# EAGLE design LED Controller (EAGLE 9.5.2)

## Sheet 1 of 3: MCU
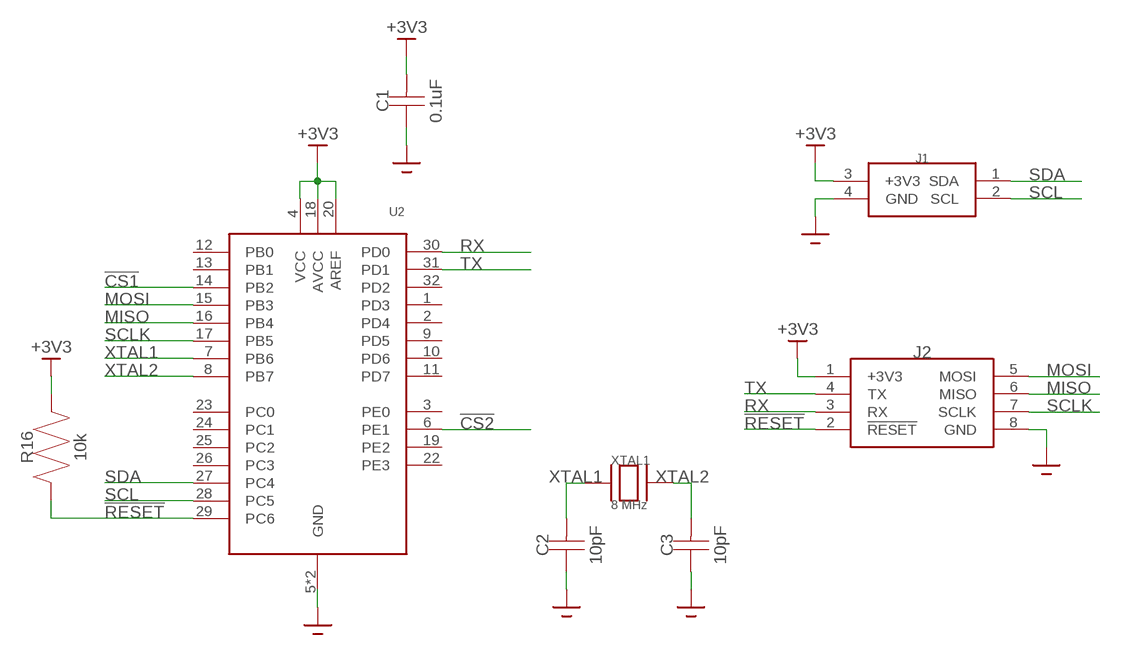
[diagram p0: schematic, sheet 1]

### Parts
C1  0.1uF  CAPACITOR0805  [0805]
C2  10pF  CAPACITOR0805  [0805]
C3  10pF  CAPACITOR0805  [0805]
J1  1-770968-0  [1-770968-0]
J2  DF1BZ-8DP-2.5DSA  [DF1BZ-8DP-2.5DSA]
R16  10k  RESISTOR0805  [0805]
U2  ATMEGA328PB32-TQFP  [ATMEGA328PB]
XTAL1  8 MHz  XRCGB  [XRCGB]

### Nets
!CS1: U2.14(PB2) ; also sheet 2
!CS2: U2.6(PE1) ; also sheet 2
!RESET: J2.2(!RESET) R16.P$1 U2.29(PC6)
+3V3: C1.P$2 J1.3(+3V3) J2.1(+3V3) R16.P$2 U2.4(VCC) U2.18(AVCC) U2.20(AREF) ; also sheet 2
GND: C1.P$1 C2.P$1 C3.P$1 J1.4(GND) J2.8(GND) U2.5(GND) U2.21(GND) ; also sheet 2
MISO: J2.6(MISO) U2.16(PB4) ; also sheet 2
MOSI: J2.5(MOSI) U2.15(PB3) ; also sheet 2
RX: J2.3(RX) U2.30(PD0)
SCL: J1.2(SCL) U2.28(PC5)
SCLK: J2.7(SCLK) U2.17(PB5) ; also sheet 2
SDA: J1.1(SDA) U2.27(PC4)
TX: J2.4(TX) U2.31(PD1)
XTAL1: C2.P$2 U2.7(PB6) XTAL1.1 XTAL1.3
XTAL2: C3.P$2 U2.8(PB7) XTAL1.2 XTAL1.4
Unconnected: U2.1(PD3) U2.2(PD4) U2.3(PE0) U2.9(PD5) U2.10(PD6) U2.11(PD7) U2.12(PB0) U2.13(PB1) U2.19(PE2) U2.22(PE3) U2.23(PC0) U2.24(PC1) U2.25(PC2) U2.26(PC3) U2.32(PD2)

## Sheet 2 of 3: IO Expanders
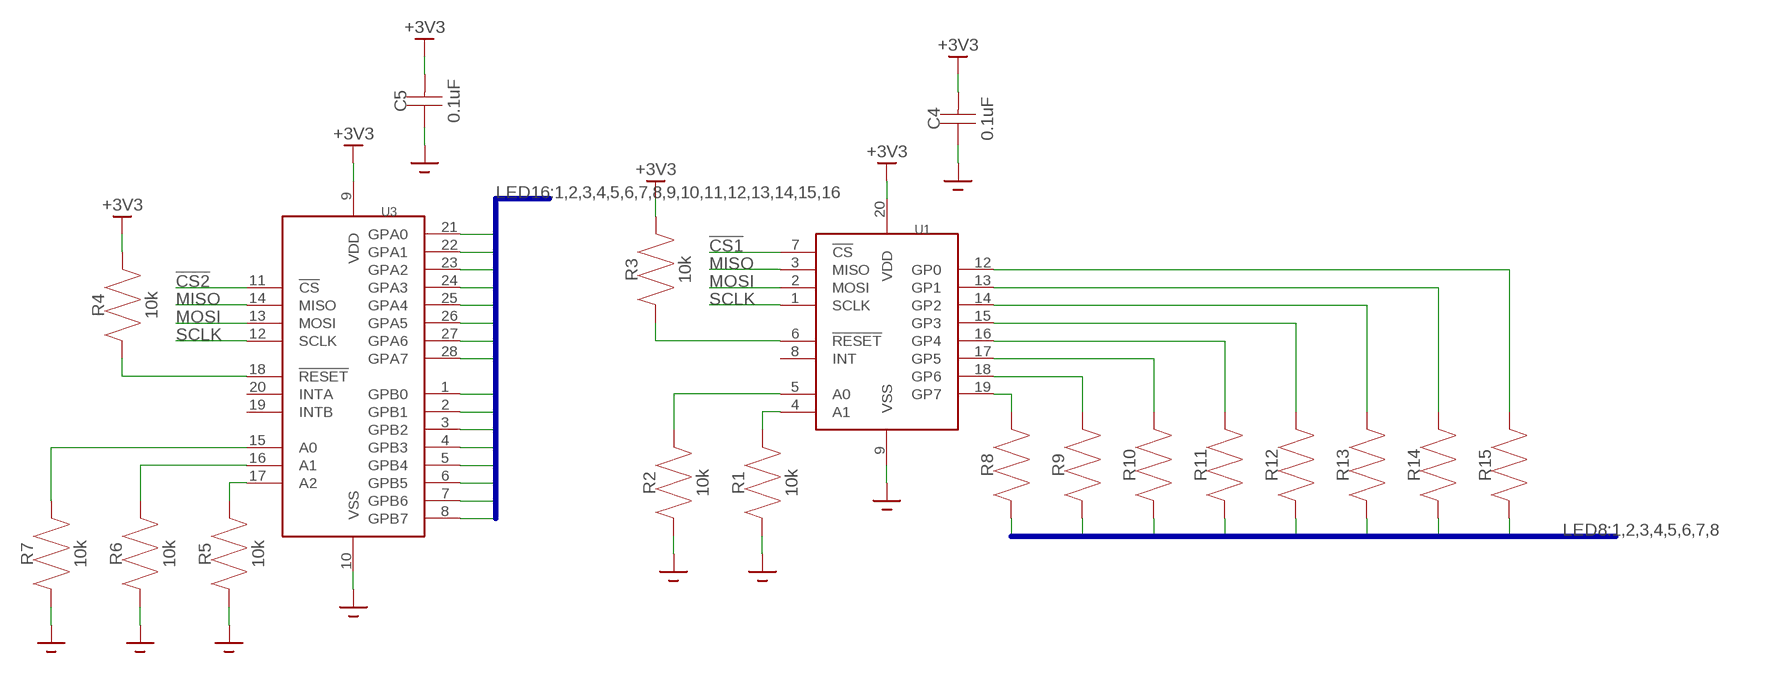
[diagram p1: schematic, sheet 2]

### Parts
C4  0.1uF  CAPACITOR0805  [0805]
C5  0.1uF  CAPACITOR0805  [0805]
R1  10k  RESISTOR0805  [0805]
R2  10k  RESISTOR0805  [0805]
R3  10k  RESISTOR0805  [0805]
R4  10k  RESISTOR0805  [0805]
R5  10k  RESISTOR0805  [0805]
R6  10k  RESISTOR0805  [0805]
R7  10k  RESISTOR0805  [0805]
R8  RESISTOR0805  [0805]
R9  RESISTOR0805  [0805]
R10  RESISTOR0805  [0805]
R11  RESISTOR0805  [0805]
R12  RESISTOR0805  [0805]
R13  RESISTOR0805  [0805]
R14  RESISTOR0805  [0805]
R15  RESISTOR0805  [0805]
U1  MCP23S08-E/SO  [MCP23S08-E/SO]
U3  MCP23S17T-E/SO  [MCP23S17T-E/SO]

### Nets
1: U3.21(GPA0) ; also sheet 3
2: U3.22(GPA1) ; also sheet 3
3: U3.23(GPA2) ; also sheet 3
4: U3.24(GPA3) ; also sheet 3
5: U3.25(GPA4) ; also sheet 3
6: U3.26(GPA5) ; also sheet 3
7: U3.27(GPA6) ; also sheet 3
8: U3.28(GPA7) ; also sheet 3
9: U3.1(GPB0) ; also sheet 3
10: U3.2(GPB1) ; also sheet 3
11: U3.3(GPB2) ; also sheet 3
12: U3.4(GPB3) ; also sheet 3
13: U3.5(GPB4) ; also sheet 3
14: U3.6(GPB5) ; also sheet 3
15: U3.7(GPB6) ; also sheet 3
16: U3.8(GPB7) ; also sheet 3
!CS1: U1.7(!CS) ; also sheet 1
!CS2: U3.11(!CS) ; also sheet 1
+3V3: C4.P$2 C5.P$2 R3.P$2 R4.P$2 U1.20(VDD) U3.9(VDD) ; also sheet 1
A: R15.P$1 ; also sheet 3
B: R14.P$1 ; also sheet 3
C: R13.P$1 ; also sheet 3
D: R12.P$1 ; also sheet 3
E: R11.P$1 ; also sheet 3
F: R10.P$1 ; also sheet 3
G: R9.P$1 ; also sheet 3
GND: C4.P$1 C5.P$1 R1.P$1 R2.P$1 R5.P$1 R6.P$1 R7.P$1 U1.9(VSS) U3.10(VSS) ; also sheet 1
H: R8.P$1 ; also sheet 3
MISO: U1.3(MISO) U3.14(MISO) ; also sheet 1
MOSI: U1.2(MOSI) U3.13(MOSI) ; also sheet 1
N$1: R1.P$2 U1.4(A1)
N$2: R2.P$2 U1.5(A0)
N$3: R3.P$1 U1.6(!RESET)
N$4: R4.P$1 U3.18(!RESET)
N$5: R5.P$2 U3.17(A2)
N$6: R6.P$2 U3.16(A1)
N$7: R7.P$2 U3.15(A0)
N$8: R8.P$2 U1.19(GP7)
N$9: R9.P$2 U1.18(GP6)
N$10: R10.P$2 U1.17(GP5)
N$11: R11.P$2 U1.16(GP4)
N$12: R12.P$2 U1.15(GP3)
N$13: R13.P$2 U1.14(GP2)
N$14: R14.P$2 U1.13(GP1)
N$15: R15.P$2 U1.12(GP0)
SCLK: U1.1(SCLK) U3.12(SCLK) ; also sheet 1
Unconnected: U1.8(INT) U3.19(INTB) U3.20(INTA)

### Buses
LED8:1,2,3,4,5,6,7,8
LED16:1,2,3,4,5,6,7,8,9,10,11,12,13,14,15,16

## Sheet 3 of 3: Interface
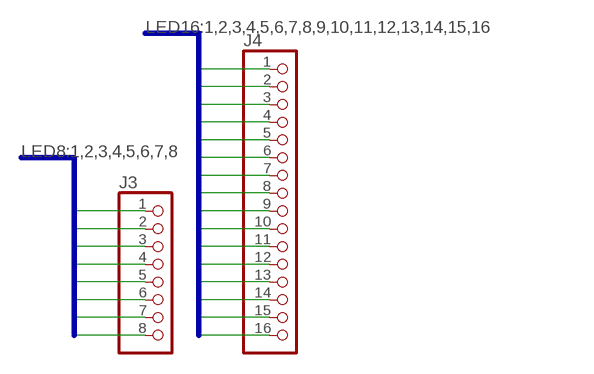
[diagram p2: schematic, sheet 3]

### Parts
J3  LED8  [LED8]
J4  LED16  [LED16]

### Nets
1: J4.1 ; also sheet 2
2: J4.2 ; also sheet 2
3: J4.3 ; also sheet 2
4: J4.4 ; also sheet 2
5: J4.5 ; also sheet 2
6: J4.6 ; also sheet 2
7: J4.7 ; also sheet 2
8: J4.8 ; also sheet 2
9: J4.9 ; also sheet 2
10: J4.10 ; also sheet 2
11: J4.11 ; also sheet 2
12: J4.12 ; also sheet 2
13: J4.13 ; also sheet 2
14: J4.14 ; also sheet 2
15: J4.15 ; also sheet 2
16: J4.16 ; also sheet 2
A: J3.1 ; also sheet 2
B: J3.2 ; also sheet 2
C: J3.3 ; also sheet 2
D: J3.4 ; also sheet 2
E: J3.5 ; also sheet 2
F: J3.6 ; also sheet 2
G: J3.7 ; also sheet 2
H: J3.8 ; also sheet 2

### Buses
LED8:1,2,3,4,5,6,7,8
LED16:1,2,3,4,5,6,7,8,9,10,11,12,13,14,15,16

## Library data of the parts
C1-C5 = Zach:CAPACITOR
J1 = Zach:1-770968-0
J2 = Zach:DF1BZ-8DP-2.5DSA
J3 = Zach:LED8
J4 = Zach:LED16
R1-R16 = Zach:RESISTOR
U1 = Zach:MCP23S08-E/SO
U2 = Zach:ATMEGA328PB
U3 = Zach:MCP23S17T-E/SO
XTAL1 = Zach:XRCGB

## Board
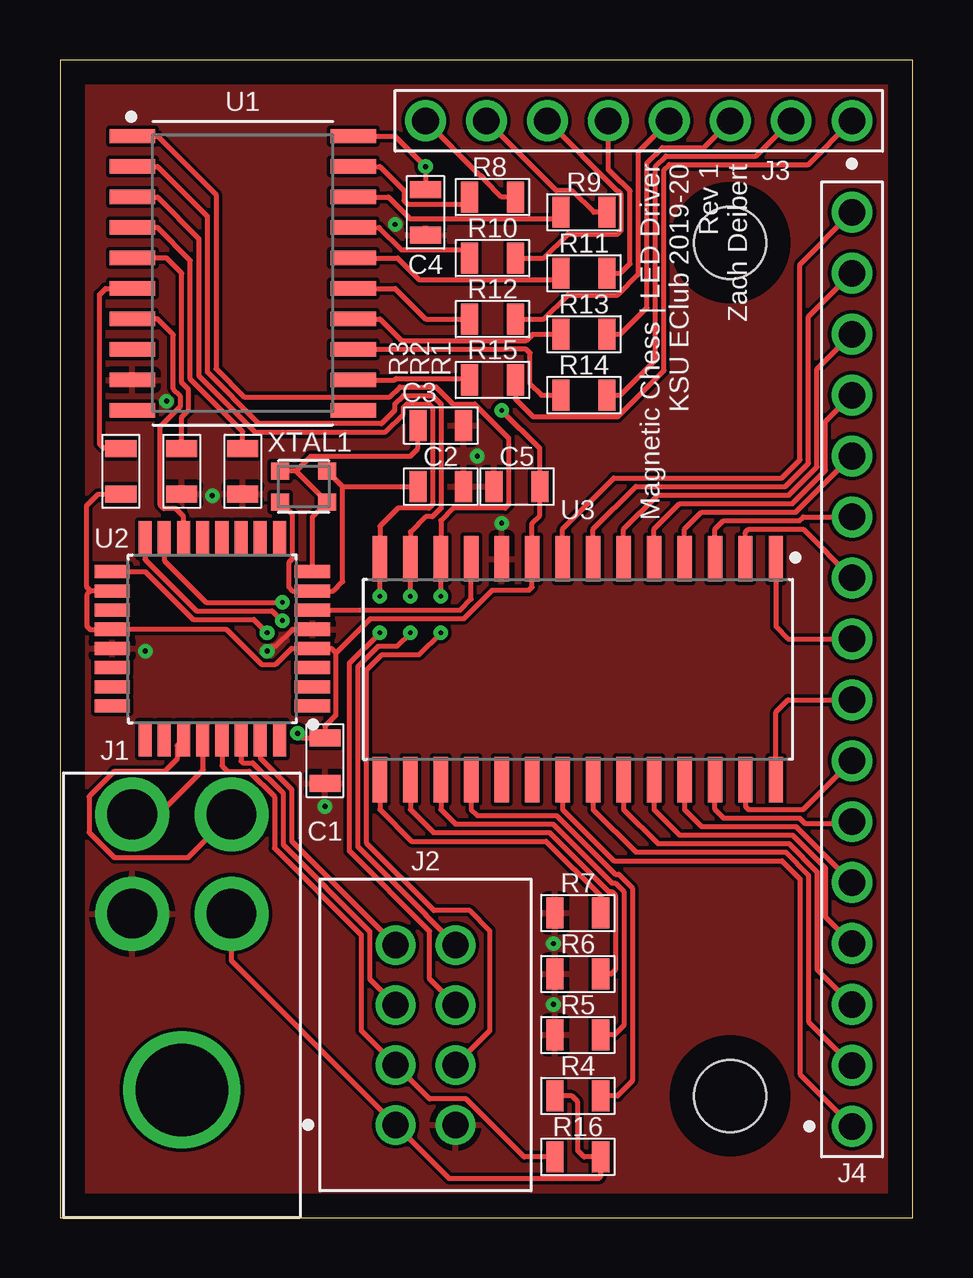
[diagram p3: board, top side]
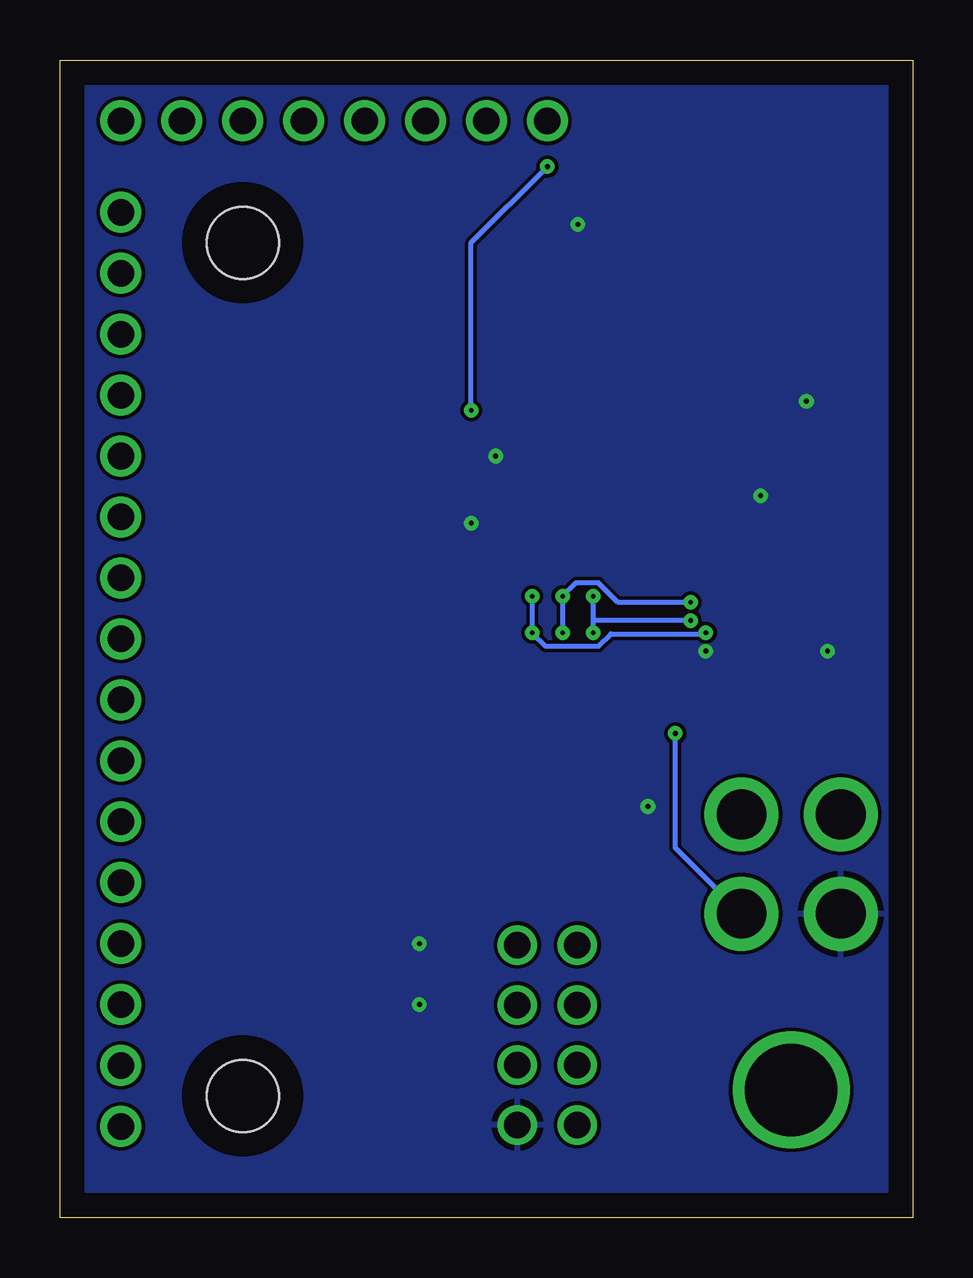
[diagram p4: board, bottom side, seen from below]

Size 35.56 x 48.26 mm. Coordinates in mm from the lower left corner, seen from the top.
Outline: 0,0 35.56,0 35.56,48.26 0,48.26 0,0
Copper layers (1*16): Top 0.035mm / dielectric 1.5mm / Bottom 0.035mm
Design rules "default *": minimum track width 6mil, minimum drill 0.2mm, track to track 6mil, track to pad 6mil, pad to pad 6mil, via to via 6mil, smd to smd 6mil, copper to edge 40mil, drill to drill 6mil, minimum pad ring 10mil, minimum via ring 8mil, stop-mask expansion 4mil, vias tented up to drill 0mil, thermal gap 10mil
Holes 3 mm at 27.94,40.64 27.94,5.08

### Footprints (pad centres in the part's own frame; a part is rotated, then mirrored left to right if it is on the bottom)
0805 = smd 0.711 x 1.295: P$1 -0.953,0; P$2 0.953,0
1-770968-0 = drill 2.07: 1 2.07,16.81; 2 -2.07,16.81; 3 2.07,12.67; 4 -2.07,12.67 | drill 3.86: 5 0,5.33
DF1BZ-8DP-2.5DSA = drill 1.1: 1 -3.75,1.25; 2 -1.25,1.25; 3 1.25,1.25; 4 3.75,1.25; 5 3.75,-1.25; 6 1.25,-1.25; 7 -1.25,-1.25; 8 -3.75,-1.25
LED8 = drill 1.105 pad 1.705: 1 0,0; 2 2.54,0; 3 5.08,0; 4 7.62,0; 5 10.16,0; 6 12.7,0; 7 15.24,0; 8 17.78,0
LED16 = drill 1.105 pad 1.705: 1 0,0; 2 2.54,0; 3 5.08,0; 4 7.62,0; 5 10.16,0; 6 12.7,0; 7 15.24,0; 8 17.78,0; 9 20.32,0; 10 22.86,0; 11 25.4,0; 12 27.94,0; 13 30.48,0; 14 33.02,0; 15 35.56,0; 16 38.1,0
MCP23S08-E/SO = smd 1.901 x 0.599: 1 -4.605,5.715; 2 -4.605,4.445; 3 -4.605,3.175; 4 -4.605,1.905; 5 -4.605,0.635; 6 -4.605,-0.635; 7 -4.605,-1.905; 8 -4.605,-3.175; 9 -4.605,-4.445; 10 -4.605,-5.715; 11 4.605,-5.715; 12 4.605,-4.445; 13 4.605,-3.175; 14 4.605,-1.905; 15 4.605,-0.635; 16 4.605,0.635; 17 4.605,1.905; 18 4.605,3.175; 19 4.605,4.445; 20 4.605,5.715
ATMEGA328PB = smd 1.469 x 0.547: 1 -4.171,2.8; 2 -4.171,2; 3 -4.171,1.2; 4 -4.171,0.4; 5 -4.171,-0.4; 6 -4.171,-1.2; 7 -4.171,-2; 8 -4.171,-2.8; 17 4.171,-2.8; 18 4.171,-2; 19 4.171,-1.2; 20 4.171,-0.4; 21 4.171,0.4; 22 4.171,1.2; 23 4.171,2; 24 4.171,2.8 | smd 0.547 x 1.469: 9 -2.8,-4.171; 10 -2,-4.171; 11 -1.2,-4.171; 12 -0.4,-4.171; 13 0.4,-4.171; 14 1.2,-4.171; 15 2,-4.171; 16 2.8,-4.171; 25 2.8,4.171; 26 2,4.171; 27 1.2,4.171; 28 0.4,4.171; 29 -0.4,4.171; 30 -1.2,4.171; 31 -2,4.171; 32 -2.8,4.171
MCP23S17T-E/SO = smd 1.901 x 0.599: 1 -4.605,8.255; 2 -4.605,6.985; 3 -4.605,5.715; 4 -4.605,4.445; 5 -4.605,3.175; 6 -4.605,1.905; 7 -4.605,0.635; 8 -4.605,-0.635; 9 -4.605,-1.905; 10 -4.605,-3.175; 11 -4.605,-4.445; 12 -4.605,-5.715; 13 -4.605,-6.985; 14 -4.605,-8.255; 15 4.605,-8.255; 16 4.605,-6.985; 17 4.605,-5.715; 18 4.605,-4.445; 19 4.605,-3.175; 20 4.605,-1.905; 21 4.605,-0.635; 22 4.605,0.635; 23 4.605,1.905; 24 4.605,3.175; 25 4.605,4.445; 26 4.605,5.715; 27 4.605,6.985; 28 4.605,8.255
XRCGB = smd 0.75 x 0.7: 1 0.975,0.65; 2 -0.975,0.65; 3 -0.975,-0.65; 4 0.975,-0.65

### Placement (x,y rotation side)
C1  11.05,19.05 90 top
C2  15.88,30.48 180 top
C3  15.88,33.02 180 top
C4  15.24,41.91 90 top
C5  19.05,30.48 0 top
J1  5.08,0 0 top
J2  15.24,7.62 90 top
J3  33.02,45.72 180 top
J4  33.02,3.81 90 top
R1  7.62,31.11 90 top
R2  5.08,31.11 90 top
R3  2.54,31.11 270 top
R4  21.59,5.08 180 top
R5  21.59,7.62 0 top
R6  21.59,10.16 0 top
R7  21.59,12.7 0 top
R8  18.03,42.55 180 top
R9  21.84,41.91 180 top
R10  18.03,40.01 180 top
R11  21.84,39.37 180 top
R12  18.03,37.47 180 top
R13  21.84,36.83 180 top
R14  21.84,34.29 180 top
R15  18.03,34.92 180 top
R16  21.59,2.54 0 top
U1  7.62,39.37 0 top
U2  6.35,24.13 180 top
U3  21.59,22.86 270 top
XTAL1  10.16,30.48 0 top

### Tracks (layer width: path | path; a pad name or v marks a point on that pad's centre or on a via)
1
  Top 0.203: U3.21 20.95,17.02 23.09,14.88 30.09,14.88 30.85,14.13 30.85,5.98 J4.1
2
  Top 0.203: U3.22 22.23,17.02 24,15.24 30.24,15.24 31.2,14.28 31.2,8.17 J4.2
3
  Top 0.203: U3.23 23.5,17.02 24.92,15.6 30.39,15.6 31.56,14.43 31.56,10.35 J4.3
4
  Top 0.203: U3.24 24.77,17.02 25.83,15.95 30.54,15.95 31.91,14.57 31.91,12.54 J4.4
5
  Top 0.203: U3.25 26.04,17.02 26.75,16.31 30.68,16.31 J4.5
6
  Top 0.203: U3.26 27.3,17.02 27.66,16.66 30.83,16.66 31.05,16.44 32.95,16.44 J4.6
7
  Top 0.203: U3.27 28.57,17.14 28.7,17.02 30.99,17.02 J4.7
8
  Top 0.203: U3.28 29.84,21.08 30.35,21.59 J4.8
9
  Top 0.203: U3.1 29.84,24.64 30.35,24.13 J4.9
10
  Top 0.203: U3.2 28.57,28.57 28.7,28.7 30.99,28.7 J4.10
11
  Top 0.203: U3.3 27.3,28.7 27.66,29.06 30.83,29.06 30.98,29.21 J4.11
12
  Top 0.203: U3.4 26.04,28.7 26.75,29.41 30.68,29.41 J4.12
13
  Top 0.203: U3.5 24.77,28.7 25.83,29.77 30.54,29.77 31.91,31.15 31.91,33.18 J4.13
14
  Top 0.203: U3.6 23.5,28.7 24.92,30.12 30.39,30.12 31.56,31.29 31.56,35.37 J4.14
15
  Top 0.203: U3.7 22.23,28.7 24,30.48 30.24,30.48 31.2,31.44 31.2,37.55 J4.15
16
  Top 0.203: U3.8 20.95,28.7 23.09,30.84 30.09,30.84 30.85,31.59 30.85,39.74 J4.16
!CS1
  Top 0.203: U2.14 5.15,29.23 4.83,29.55 4.33,29.55 4.18,29.7 4.18,32.98 5,33.8 5,34.27 4.72,34.55 4.72,36.8 4.06,37.47 U1.7
!CS2
  Top 0.203: U2.6 16.69,25.33 17.14,25.78 U3.11
!RESET
  Top 0.203: U2.29 6.75,18.84 6.99,18.61 7.89,18.61 8.95,17.55 8.95,15.41 12.55,11.8 12.55,7.8 J2.2 15.41,4.95 16.94,4.95 19.35,2.54 R16.P$1
+3V3  (via drill 0.2)
  Top 0.203: U2.18 1.28,26.13 | 1.28,26.13 1.12,26.29 1.12,29.69 1.59,30.16 R3.P$2 | 1.28,26.13 1.12,25.97 1.12,24.66 1.27,24.51 2.16,24.51 U2.20 6.94,24.53 8.4,23.07 8.99,23.07 9.65,23.73 U2.4 11.32,23.73 11.51,23.54 | 11.51,23.54 11.51,20.95 11.05,20.49 C1.P$2 10.1,20 v9.91,20.19 | J1.3 7.15,10.71 J2.1 16.22,1.64 22.47,1.64 22.54,1.71 R16.P$2 21.84,2.54 21.59,2.79 21.59,4.83 21.34,5.08 R4.P$2 | 11.51,23.54 12.94,24.97 16.84,24.97 18.03,26.16 19.56,26.16 19.68,26.29 U3.9 19.68,28.96 20,29.27 C5.P$2 20,32.07 v18.41,33.66 | U1.20 13.97,45.09 v15.24,43.81 C4.P$2
  Bottom 0.203: J1.3 9.91,15.43 v9.91,20.19 | v18.41,33.66 18.41,40.64 v15.24,43.81
A
  Top 0.203: R15.P$1 18.99,34.13 19.72,33.39 23.26,33.39 25.18,35.31 25.18,43.69 25.4,43.9 31.2,43.9 J3.1
B
  Top 0.203: R14.P$1 23.37,34.29 24.83,35.75 24.83,43.83 25.25,44.26 29.02,44.26 J3.2
C
  Top 0.203: R13.P$1 23.37,36.83 24.47,37.94 24.47,43.98 25.11,44.61 26.83,44.61 J3.3
D
  Top 0.203: R12.P$1 20.16,37.47 21.17,38.47 23.26,38.47 24.12,39.33 24.12,44.44 J3.4
E
  Top 0.203: R11.P$1 23.37,39.37 23.76,39.76 23.76,42.81 23.41,43.17 23.38,43.17 22.86,43.68 J3.5
F
  Top 0.203: R10.P$1 20.16,40.01 21.17,41.01 23.26,41.01 23.41,41.16 23.41,42.66 23.26,42.81 23.23,42.81 J3.6
G
  Top 0.203: J3.7 20.69,42.81 21.35,42.81 22.25,41.91 R9.P$1
GND  (via drill 0.2)
  Top 0.203: v8.64,23.62 8.84,23.83 8.99,23.83 9.7,24.53 U2.5
  other vias: 13.97,41.4 4.45,34.04 6.35,30.1 3.56,23.62 11.05,17.14 20.57,11.43 20.57,8.89 18.41,28.96 17.4,31.75
  pour Top: 0,0 0,48.26 35.56,48.26 35.56,0
  pour Bottom: 0,0 0,48.26 35.56,48.26 35.56,0
H
  Top 0.203: R8.P$1 18.41,42.55 17.69,43.27 17.69,43.3 17.54,43.45 17.51,43.45 J3.8
MISO  (via drill 0.2)
  Top 0.203: U1.3 4.06,42.55 5.79,40.82 5.79,35.1 8.14,32.75 13.55,32.75 14.31,33.51 14.31,33.77 14.46,33.92 15.38,33.92 15.53,33.77 15.53,29.73 15.38,29.58 14.08,29.58 13.34,28.83 U3.14 v13.34,25.91 | J2.6 15.41,9.95 15.41,11.95 12.07,15.29 12.07,23.12 v13.34,24.38 | U2.16 3.55,27.44 5.69,25.3 8.84,25.3 9.04,25.1 9.07,25.1 v9.27,24.89
  Bottom 0.203: v13.34,25.91 13.34,24.89 | 13.34,24.89 v13.34,24.38 | v9.27,24.89 13.34,24.89
MOSI  (via drill 0.2)
  Top 0.203: U1.2 4.06,43.81 6.15,41.73 6.15,35.24 8.29,33.1 13.4,33.1 13.96,33.66 13.96,33.92 14.31,34.28 15.53,34.28 15.89,33.92 15.89,29.58 15.53,29.22 15.24,29.22 14.61,28.59 U3.13 v14.61,25.91 | J2.5 15.24,12.62 15.24,12.65 12.43,15.47 12.43,22.97 13.28,23.83 14.05,23.83 v14.61,24.38 | U2.15 4.35,27.4 6.1,25.65 v9.27,25.65
  Bottom 0.203: v14.61,24.38 v14.61,25.91 14.05,26.46 13.1,26.46 12.29,25.65 v9.27,25.65
N$1
  Top 0.203: U1.4 4.06,41.27 5.44,39.9 5.44,34.95 7.62,32.77 R1.P$2
N$2
  Top 0.203: U1.5 4.45,40.01 5.08,39.37 5.08,34.8 5.36,34.52 5.36,33.66 5.08,33.38 R2.P$2
N$3
  Top 0.203: R3.P$1 1.84,32.07 1.65,32.26 1.65,38.48 1.91,38.73 U1.6
N$4
  Top 0.203: U3.18 17.14,17.02 17.4,16.76 20.71,16.76 22.86,14.61 22.94,14.53 23.16,14.31 23.3,14.31 23.86,13.75 23.86,5.7 23.24,5.08 R4.P$1
N$5
  Top 0.203: U3.17 15.88,17.02 16.48,16.41 20.56,16.41 23.01,13.96 23.15,13.96 23.51,13.6 23.51,8.01 23.11,7.62 R5.P$2
N$6
  Top 0.203: U3.16 14.61,17.02 15.57,16.05 20.41,16.05 22.86,13.6 23,13.6 23.15,13.45 23.15,10.32 22.99,10.16 R6.P$2
N$7
  Top 0.203: U3.15 13.34,17.02 14.66,15.7 20.26,15.7 22.54,13.42 R7.P$2
N$8
  Top 0.203: U1.19 13.34,43.81 14.34,42.81 14.34,42.4 14.49,42.25 16.79,42.25 R8.P$2
N$9
  Top 0.203: U1.18 13.69,42.55 14.59,41.64 20.62,41.64 R9.P$2
N$10
  Top 0.203: U1.17 13.31,41.27 14.24,40.35 16.74,40.35 R10.P$2
N$11
  Top 0.203: U1.16 14.08,40.01 14.98,39.1 20.62,39.1 R11.P$2
N$12
  Top 0.203: U1.15 13.97,38.73 15.24,37.47 R12.P$2
N$13
  Top 0.203: U1.14 13.34,37.47 14.24,36.56 19.45,36.56 19.71,36.83 R13.P$2
N$14
  Top 0.203: U1.13 18.54,36.2 18.55,36.21 19.43,36.21 19.6,36.04 19.6,34.76 20.07,34.29 R14.P$2
N$15
  Top 0.203: U1.12 13.96,34.92 14.02,34.99 17.02,34.99 R15.P$2
RX
  Top 0.203: U2.30 7.55,19.03 7.62,18.96 8.04,18.96 9.3,17.7 9.3,15.55 12.91,11.95 12.91,9.95 J2.3
SCL
  Top 0.203: J1.2 4.11,16.81 5.97,18.67 5.97,19.94 U2.28
SCLK  (via drill 0.2)
  Top 0.203: U1.1 4.06,45.09 6.5,42.65 6.5,35.39 7.69,34.21 13.74,34.21 14.17,34.63 15.68,34.63 16.39,33.92 17.29,33.92 18.71,32.5 18.71,29.73 18.56,29.58 16.39,29.58 15.88,29.06 U3.12 v15.88,25.91 | J2.7 17.93,7.8 17.93,11.96 17.08,12.8 15.59,12.8 12.78,15.61 12.78,22.82 13.43,23.47 14.96,23.47 v15.88,24.38 | U2.17 3.56,26.93 5.54,24.94 8.08,24.94 v8.64,24.38
  Bottom 0.203: v15.88,25.91 v15.88,24.38 15.32,23.83 13.1,23.83 12.6,24.34 8.69,24.34 v8.64,24.38
SDA
  Top 0.203: U2.27 4.88,19.69 4.88,19.12 4.37,18.61 2.27,18.61 1.21,17.55 1.21,16.07 2.27,15.01 5.35,15.01 J1.1
TX
  Top 0.203: U2.31 8.35,19.16 9.66,17.85 9.66,15.7 J2.4
XTAL1
  Top 0.203: XTAL1.3 9.68,29.34 9.68,27.45 9.53,27.31 9.53,26.28 9.68,26.13 U2.7 11.4,26.13 11.79,26.52 11.79,30.48 | XTAL1.1 11.79,30.48 | 11.79,30.48 C2.P$2
XTAL2
  Top 0.203: U2.8 10.52,29.22 XTAL1.4 9.84,31.13 | 9.84,31.13 XTAL1.2 | C3.P$2 14.92,32.07 14.59,31.73 10.44,31.73 9.84,31.13

### Text on the board
tPlace: Magnetic Chess | LED Driver / KSU EClub 2019-20 / Rev 1 / Zach Deibert